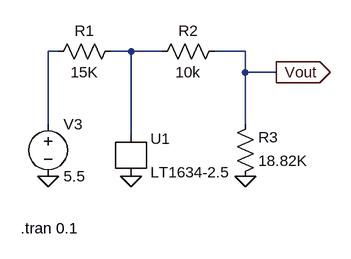
[diagram p0: schematic SpaendingsRef_offset.asc]
SpaendingsRef_offset.asc, the LTspice schematic file:
Version 4
SHEET 1 880 680
WIRE -144 -464 -160 -464
WIRE -32 -464 -64 -464
WIRE 16 -464 -32 -464
WIRE 144 -464 96 -464
WIRE 144 -432 144 -464
WIRE 192 -432 144 -432
WIRE -160 -352 -160 -464
WIRE 144 -352 144 -432
WIRE -32 -336 -32 -464
FLAG 144 -272 0
FLAG -32 -272 0
FLAG 192 -432 Vout
IOPIN 192 -432 Out
FLAG -160 -272 0
SYMBOL References\\LT1634-2.5 -32 -304 R0
SYMATTR InstName U1
SYMBOL res -160 -448 R270
WINDOW 0 32 56 VTop 2
WINDOW 3 0 56 VBottom 2
SYMATTR InstName R1
SYMATTR Value 15K
SYMBOL res 0 -448 R270
WINDOW 0 32 56 VTop 2
WINDOW 3 0 56 VBottom 2
SYMATTR InstName R2
SYMATTR Value 10k
SYMBOL res 128 -256 M180
WINDOW 0 36 76 Left 2
WINDOW 3 36 40 Left 2
SYMATTR InstName R3
SYMATTR Value 18.82K
SYMBOL voltage -160 -368 R0
WINDOW 123 0 0 Left 2
WINDOW 39 0 0 Left 2
SYMATTR InstName V3
SYMATTR Value 5.5
TEXT -202 -192 Left 2 !.tran 0.1

The netlist it stands for:
* SpaendingsRef_offset.asc
XU1 N002 0 LT1634-2.5
R1 N001 N002 15K
R2 N002 Vout 10k
R3 0 Vout 18.82K
V3 N001 0 5.5
.tran 0.1
.backanno
.end